# Altium project Relays.PrjPcb
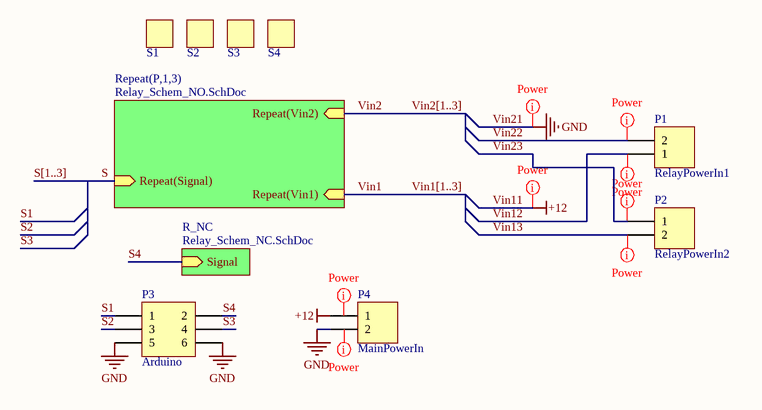
[diagram p0: Relay_Conn.SchDoc]
3 sheets, 29 parts. Net scope: hierarchical (ports join the sheet entries above them; power ports are global).
Board file: TvRRelayBoard_v2.PcbDoc
Sheets:
  Relay_Conn.SchDoc
    P1 = Relay_Schem_NO.SchDoc
    P2 = Relay_Schem_NO.SchDoc
    P3 = Relay_Schem_NO.SchDoc
    R_NC = Relay_Schem_NC.SchDoc

## Sheet Relay_Conn.SchDoc
size A4; Organization: Altium Limited; Address1: L3, 12a Rodborough Rd; Address2: Frenchs Forest; Address3: NSW; Address4: Australia 2086

### Parts
P1  RelayPowerIn1  [CONN-WAFER-2x1]
P2  RelayPowerIn2  [CONN-WAFER-2x1]
P3  Arduino  [CONN-IDC-HARTING-2x3]
P4  MainPowerIn  [CONN-WAFER-2x1]
S1  SCREW  [MECH-SCREW-M2.3]  (value not drawn)
S2  SCREW  [MECH-SCREW-M2.3]  (value not drawn)
S3  SCREW  [MECH-SCREW-M2.3]  (value not drawn)
S4  SCREW  [MECH-SCREW-M2.3]  (value not drawn)

### Sub-sheets
R_NC = Relay_Schem_NC.SchDoc: Signal (in)
Repeat(P,1,3) = Relay_Schem_NO.SchDoc: Repeat(Signal) (in), Repeat(Vin2) (in), Repeat(Vin1) (in)

### Nets
+12: P4.1  [also labelled Vin11]  [project net Vin]
Vin21: P3.5 P3.6 P4.2  [also labelled GND]
S: sheet Repeat(P,1,3)/Repeat(Signal)
S1: P3.1
S2: P3.3
S3: P3.4
S4: P3.2 ; sheet R_NC/Signal
Vin1: sheet Repeat(P,1,3)/Repeat(Vin1)
Vin2: sheet Repeat(P,1,3)/Repeat(Vin2)
Vin12: P1.1  [project net Vin]
Vin13: P2.2  [project net Vin]
Vin22: P1.2
Vin23: P2.1

### Buses and harness runs
bus S[1..3]
bus Vin1[1..3]
bus Vin2[1..3]

### Layout directives
net class Power: (no net found under the mark), Vin, Vin21, Vin22, Vin23

### Notes on the sheet
- Title
- Size:
- Date:
- A4
- Number:
- Time:
- Revision:
- Sheet
- of
- File:

### Library data of the parts
P1 P2 P4 = Header 2: Header, 2-Pin; LatestRevisionDate: 17-Jul-2002; LatestRevisionNote: Re-released for DXP Platform.; Publisher: Altium Limited
P3 = Header 3X2: Header, 3-Pin, Dual row; LatestRevisionDate: 17-Jul-2002; LatestRevisionNote: Re-released for DXP Platform.; Publisher: Altium Limited
S1-S4 = SCREW: Screw to add to schematics in order for them not to be removed from PCB

## Sheet Relay_Schem_NO.SchDoc
size A4; Organization: Altium Limited; Address1: L3, 12a Rodborough Rd; Address2: Frenchs Forest; Address3: NSW; Address4: Australia 2086
Used 3 times, as channels P1, P2, P3. Parts and nets are listed once, with the designators drawn on the sheet.
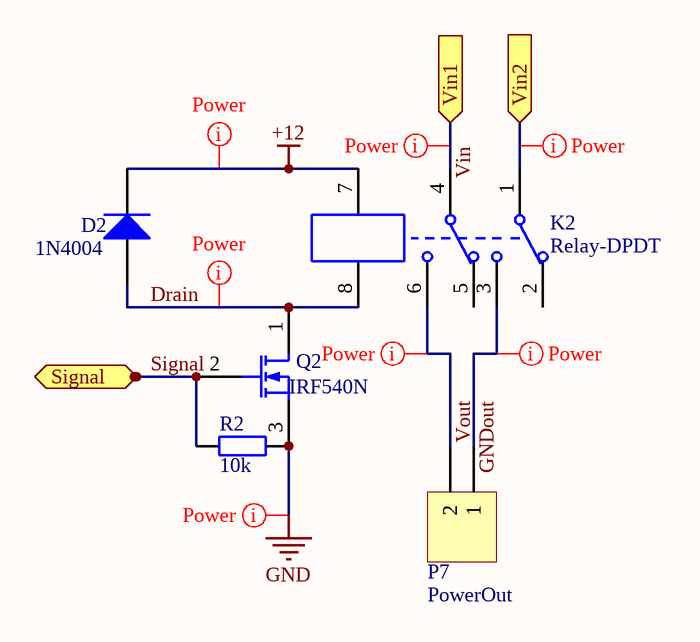
[diagram p1: Relay_Schem_NO.SchDoc]

### Parts
D2  1N4004  [DIODE-0.3-SI]
K2  Relay-DPDT  [Relay_95.12 Socket - With Screw]
P7  PowerOut  [CONN-WAFER-2x1]
Q2  IRF540N  [TO-220]
R2  10k  [RES-0.4]

### Ports
Signal (in), Vin1 (in), Vin2 (in)

### Nets
+12: D2.2(K) K2.7
GND: Q2.3(S) R2.2
Drain: D2.1(A) K2.8 Q2.1(D)
GNDout: K2.3 P7.1
Signal: Q2.2(G) R2.1 ; port Signal
Vin: K2.4 ; port Vin1
Vin2: K2.1 ; port Vin2
Vout: K2.6 P7.2

Not connected (* = marked no-connect by the designer): K2 2 5

### Channels
P1: designators end in _1; ports Signal=S1 Vin1=Vin Vin2=Vin21
P2: designators end in _2; ports Signal=S2 Vin1=Vin Vin2=Vin22
P3: designators end in _3; ports Signal=S3 Vin1=Vin Vin2=Vin23

### Layout directives
net class Power: Drain_P1, GNDout_P1, Vin, Vin21, Vout_P1

### Notes on the sheet
- Title
- Size:
- Date:
- A4
- Number:
- Time:
- Revision:
- Sheet
- of
- File:

### Library data of the parts
D2 = Diode 1N4005: 1 Amp General Purpose Rectifier; Published: 8-Jun-2000; LatestRevisionDate: 17-Jul-2002; LatestRevisionNote: Re-released for DXP Platform.; DatasheetVersion: 1998; PackageVersion: Aug-1999; PackageReference: DO-41; Publisher: Altium Limited; PackageDescription: Diode, Axial; Body 5.2 x 2.7 mm (LxDia. max), Lead Dia. 0.86 mm (max); Code_JEDEC: DO-204-AL; ComponentLink1Description: Manufacturer Link; ComponentLink1URL: http://www.fairchildsemi.com/; ComponentLink2Description: Datasheet; ComponentLink2URL: http://www.fairchildsemi.com/ds/1N%2F1N4001.pdf
K2 = Relay-DPDT: Dual-Pole Dual-Throw Relay; Published: 24-Mar-1999; LatestRevisionDate: 17-Jul-2002; LatestRevisionNote: Re-released for DXP Platform.; PackageReference: DIP-P8; Publisher: Altium Limited; PackageDescription: Relay; 8 Leads
P7 = Header 2: Header, 2-Pin; LatestRevisionDate: 17-Jul-2002; LatestRevisionNote: Re-released for DXP Platform.; Publisher: Altium Limited
Q2 = MOSFET-N: N-Channel MOSFET; pin to pad: 1>2 2>1; Published: 8-Jun-2000; LatestRevisionDate: 17-Jul-2002; LatestRevisionNote: Re-released for DXP Platform.; PackageVersion: 1995/1996; PackageReference: E3; Publisher: Altium Limited; PackageDescription: TO, Flat Index; 3 In-Line, Axial Leads; Body Dia. 4.6mm; Lead Dia. 0.5 mm (max)
R2 = Res2: Resistor; Published: 8-Jun-2000; LatestRevisionDate: 17-Jul-2002; LatestRevisionNote: Re-released for DXP Platform.; PackageReference: AXIAL-0.4; Publisher: Altium Limited; PackageDescription: Axial Device, Thru-Hole; 2 Leads; 0.4 in Pin Spacing; Value: 10k

## Sheet Relay_Schem_NC.SchDoc
size A4; Organization: Altium Limited; Address1: L3, 12a Rodborough Rd; Address2: Frenchs Forest; Address3: NSW; Address4: Australia 2086
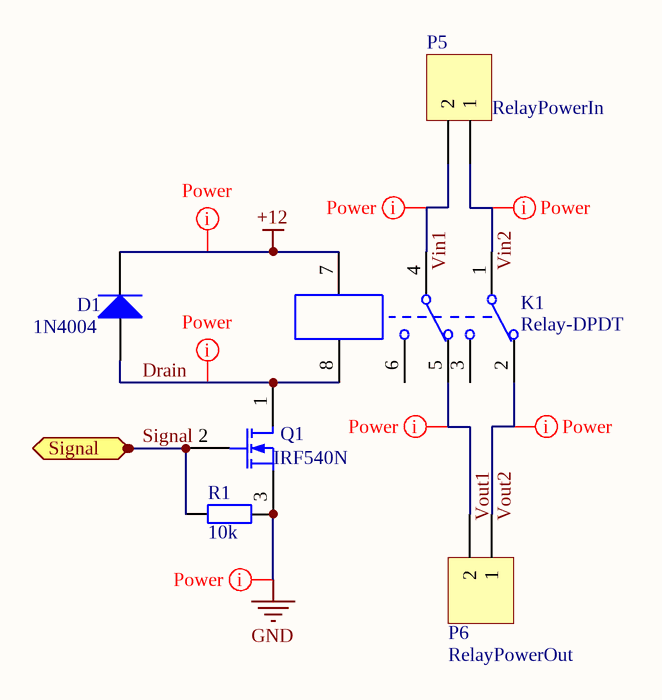
[diagram p2: Relay_Schem_NC.SchDoc]

### Parts
D1  1N4004  [DIODE-0.3-SI]
K1  Relay-DPDT  [Relay_95.12 Socket - With Screw]
P5  RelayPowerIn  [CONN-WAFER-2x1]
P6  RelayPowerOut  [CONN-WAFER-2x1]
Q1  IRF540N  [TO-220]
R1  10k  [RES-0.4]

### Ports
Signal (in)

### Nets
+12: D1.2(K) K1.7  [project net Vin]
GND: Q1.3(S) R1.2  [project net Vin21]
Drain: D1.1(A) K1.8 Q1.1(D)
Signal: Q1.2(G) R1.1 ; port Signal  [project net S4]
Vin1: K1.4 P5.2
Vin2: K1.1 P5.1
Vout1: K1.5 P6.2
Vout2: K1.2 P6.1

Not connected (* = marked no-connect by the designer): K1 3 6

### Layout directives
net class Power: Drain, Vin, Vin1, Vin2, Vin21, Vout1, Vout2

### Notes on the sheet
- Title
- Size:
- Date:
- A4
- Number:
- Time:
- Revision:
- Sheet
- of
- File:

### Library data of the parts
D1 = Diode 1N4005: 1 Amp General Purpose Rectifier; Published: 8-Jun-2000; LatestRevisionDate: 17-Jul-2002; LatestRevisionNote: Re-released for DXP Platform.; DatasheetVersion: 1998; PackageVersion: Aug-1999; PackageReference: DO-41; Publisher: Altium Limited; PackageDescription: Diode, Axial; Body 5.2 x 2.7 mm (LxDia. max), Lead Dia. 0.86 mm (max); Code_JEDEC: DO-204-AL; ComponentLink1Description: Manufacturer Link; ComponentLink1URL: http://www.fairchildsemi.com/; ComponentLink2Description: Datasheet; ComponentLink2URL: http://www.fairchildsemi.com/ds/1N%2F1N4001.pdf
K1 = Relay-DPDT: Dual-Pole Dual-Throw Relay; Published: 24-Mar-1999; LatestRevisionDate: 17-Jul-2002; LatestRevisionNote: Re-released for DXP Platform.; PackageReference: DIP-P8; Publisher: Altium Limited; PackageDescription: Relay; 8 Leads
P5 P6 = Header 2: Header, 2-Pin; LatestRevisionDate: 17-Jul-2002; LatestRevisionNote: Re-released for DXP Platform.; Publisher: Altium Limited
Q1 = MOSFET-N: N-Channel MOSFET; pin to pad: 1>2 2>1; Published: 8-Jun-2000; LatestRevisionDate: 17-Jul-2002; LatestRevisionNote: Re-released for DXP Platform.; PackageVersion: 1995/1996; PackageReference: E3; Publisher: Altium Limited; PackageDescription: TO, Flat Index; 3 In-Line, Axial Leads; Body Dia. 4.6mm; Lead Dia. 0.5 mm (max)
R1 = Res2: Resistor; Published: 8-Jun-2000; LatestRevisionDate: 17-Jul-2002; LatestRevisionNote: Re-released for DXP Platform.; PackageReference: AXIAL-0.4; Publisher: Altium Limited; PackageDescription: Axial Device, Thru-Hole; 2 Leads; 0.4 in Pin Spacing; Value: 10k

## Nets that join several sheets
Vin: Relay_Conn (P4.1), P1 (D2_1.2 K2_1.4 K2_1.7), P2 (D2_2.2 K2_2.7), P3 (D2_3.2 K2_3.7), Relay_Schem_NC (D1.2 K1.7)
Vin21: Relay_Conn (P3.5 P3.6 P4.2), P1 (K2_1.1 Q2_1.3 R2_1.2), P2 (Q2_2.3 R2_2.2), P3 (Q2_3.3 R2_3.2), Relay_Schem_NC (Q1.3 R1.2)
S1: Relay_Conn (P3.1), P1 (Q2_1.2 R2_1.1)
S2: Relay_Conn (P3.3), P2 (Q2_2.2 R2_2.1)
S3: Relay_Conn (P3.4), P3 (Q2_3.2 R2_3.1)
S4: Relay_Conn (P3.2), Relay_Schem_NC (Q1.2 R1.1)
Vin: Relay_Conn (P1.1), P2 (K2_2.4)
Vin: Relay_Conn (P2.2), P3 (K2_3.4)
Vin22: Relay_Conn (P1.2), P2 (K2_2.1)
Vin23: Relay_Conn (P2.1), P3 (K2_3.1)